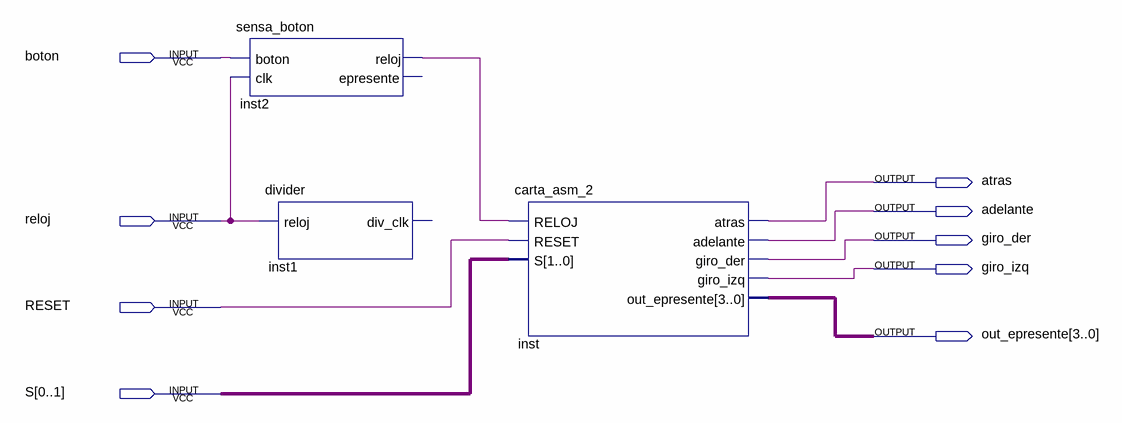
[diagram p0: schematic sheet]
// Quartus schematic Practica2.bdf as structural Verilog: 3 symbols, 9 pins
module Practica2 (
  input  boton,
  input  reloj,
  input  RESET,
  input  [0:1] S,
  output atras,
  output adelante,
  output giro_der,
  output giro_izq,
  output [3:0] out_epresente
);

  wire inst2_reloj;

  sensa_boton inst2 (.boton(boton), .clk(reloj), .reloj(inst2_reloj));  // open: epresente
  divider inst1 (.reloj(reloj));  // open: div_clk
  carta_asm_2 inst (
    .RELOJ(inst2_reloj), .RESET(RESET), .S(S), .atras(atras), .adelante(adelante), .giro_der(giro_der),
    .giro_izq(giro_izq), .out_epresente(out_epresente));
endmodule
